# EAGLE design Dormio (EAGLE 9.3.0)
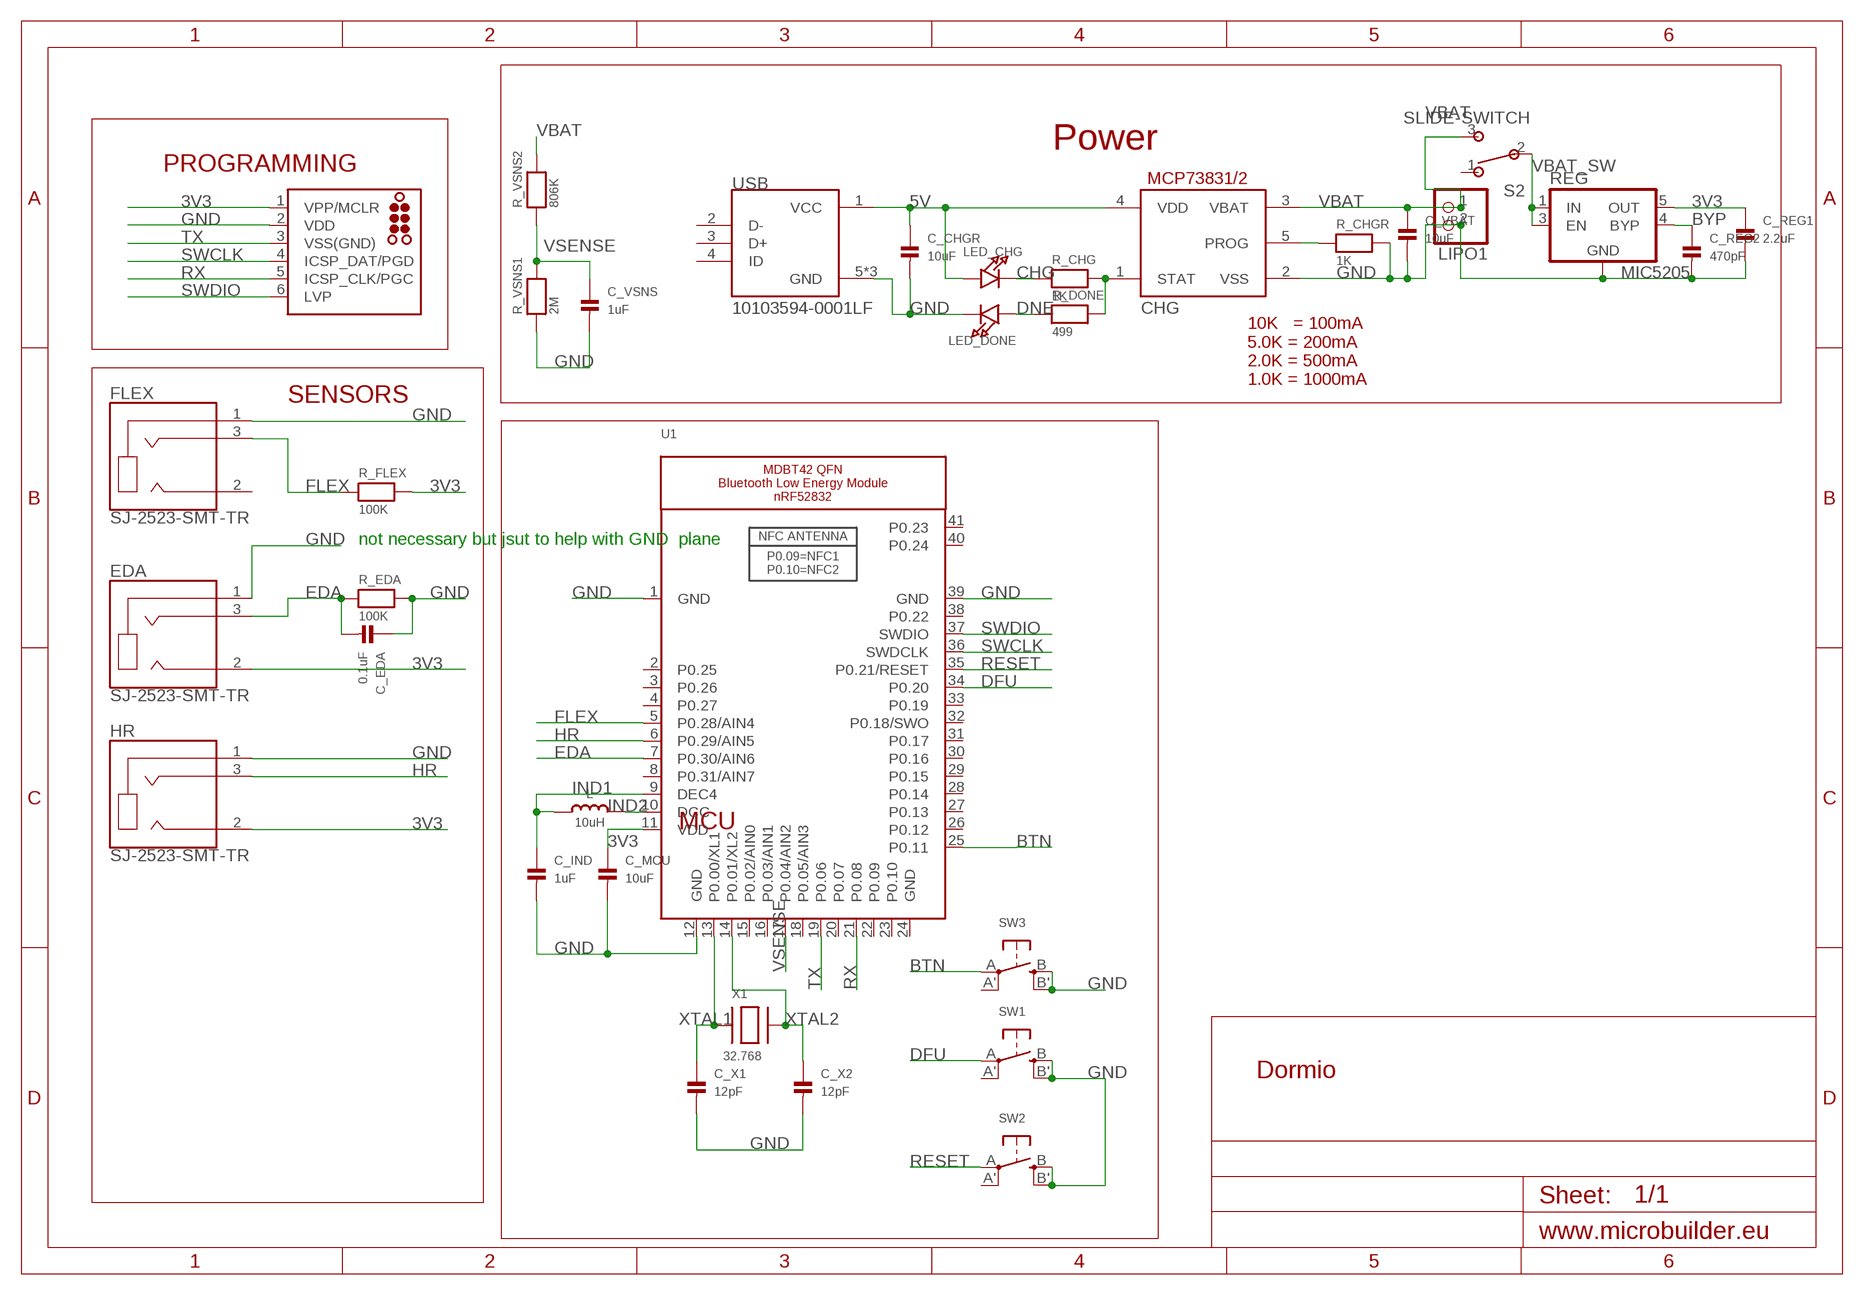
[diagram p0: schematic, sheet 1]

## Parts
C_CHGR  10uF  CAP_CERAMIC1206  [1206]
C_EDA  0.1uF  CAP_CERAMIC1206  [1206]
C_IND  1uF  CAP_CERAMIC1206  [1206]
C_MCU  10uF  CAP_CERAMIC1206  [1206]
C_REG1  2.2uF  CAP_CERAMIC1206  [1206]
C_REG2  470pF  CAP_CERAMIC1206  [1206]
C_VBAT  10uF  CAP_CERAMIC1206  [1206]
C_VSNS  1uF  CAP_CERAMIC1206  [1206]
C_X1  12pF  CAP_CERAMIC1206  [1206]
C_X2  12pF  CAP_CERAMIC1206  [1206]
CHG  MCP73831/OT  [SOT23-5L]
EDA  SJ-2523-SMT-TR  [CUI_SJ-2523-SMT-TR]
FLEX  SJ-2523-SMT-TR  [CUI_SJ-2523-SMT-TR]
HR  SJ-2523-SMT-TR  [CUI_SJ-2523-SMT-TR]
J1  TC2030-MCP-NL  [TC2030-MCP-NL]
L  10uH  MICROBUILDER_INDUCTOR  [MICROBUILDER_INDUCTOR_1007]
LED_CHG  LED1206  [CHIPLED_1206]
LED_DONE  LED1206  [CHIPLED_1206]
LIPO1  JST_2PIN-SMT-RA  [JST-PH-2-SMT-RA]
R_CHG  1K  RESISTOR1206  [1206]
R_CHGR  1K  RESISTOR1206  [1206]
R_DONE  499  RESISTOR1206  [1206]
R_EDA  100K  RESISTOR1206  [1206]
R_FLEX  100K  RESISTOR1206  [1206]
R_VSNS1  2M  RESISTOR1206  [1206]
R_VSNS2  806K  RESISTOR1206  [1206]
REG  MIC5205  [SOT23-5]
S2  SLIDE-SWITCH  [AYZ0102AGRLC]
SW1  MICROBUILDER_SWITCH_TACT_SMT4.6X2.8  [MICROBUILDER_BTN_KMR2_4.6X2.8]
SW2  MICROBUILDER_SWITCH_TACT_SMT4.6X2.8  [MICROBUILDER_BTN_KMR2_4.6X2.8]
SW3  MICROBUILDER_SWITCH_TACT_SMT4.6X2.8  [MICROBUILDER_BTN_KMR2_4.6X2.8]
U1  MICROBUILDER_NRF52832_MODULE_MDBT42  [MICROBUILDER_BLE_MODULE_RAYTAC_MDBT42]
USB  10103594-0001LF  [FCI_10103594-0001LF]
X1  32.768  XTAL-3.2X1.5  [XTAL3215]

## Nets
3V3: C_MCU.1 C_REG1.1 EDA.2 HR.2 J1.1(VPP/MCLR) R_FLEX.2 REG.5(OUT) U1.11(VDD)
5V: C_CHGR.1 CHG.4(VDD) LED_CHG.A USB.1(VCC)
BTN: SW3.A(P) U1.25(P0.11)
BYP: C_REG2.1 REG.4(BYP)
CHG: LED_CHG.C R_CHG.1
DFU: SW1.A(P) U1.34(P0.20)
DNE: LED_DONE.A R_DONE.1
EDA: C_EDA.2 EDA.3 R_EDA.1 U1.7(P0.30/AIN6)
FLEX: FLEX.3 R_FLEX.1 U1.5(P0.28/AIN4)
GND: C_CHGR.2 C_EDA.1 C_IND.2 C_MCU.2 C_REG1.2 C_REG2.2 C_VBAT.2 C_VSNS.2 C_X1.2 C_X2.2 CHG.2(VSS) EDA.1 FLEX.1 HR.1 J1.2(VDD) LED_DONE.C LIPO1.2 R_CHGR.2 R_EDA.2 R_VSNS1.1 REG.2(GND) SW1.B'(S1) SW1.B(S) SW2.B'(S1) SW2.B(S) SW3.B'(S1) SW3.B(S) U1.1(GND) U1.12(GND) U1.39(GND) USB.5(GND) USB.P3(GND) USB.P4(GND)
HR: HR.3 U1.6(P0.29/AIN5)
IND1: C_IND.1 L.P$1 U1.9(DEC4)
IND2: L.P$2 U1.10(DCC)
PROG: CHG.5(PROG) R_CHGR.1
RESET: SW2.A(P) U1.35(P0.21/RESET)
RX: J1.5(ICSP_CLK/PGC) U1.21(P0.08)
STAT: CHG.1(STAT) R_CHG.2 R_DONE.2
SWCLK: J1.4(ICSP_DAT/PGD) U1.36(SWDCLK)
SWDIO: J1.6(LVP) U1.37(SWDIO)
TX: J1.3(VSS(GND)) U1.19(P0.06)
VBAT: C_VBAT.1 CHG.3(VBAT) LIPO1.1 R_VSNS2.2 S2.3
VBAT_SW: REG.1(IN) REG.3(EN) S2.2
VSENSE: C_VSNS.1 R_VSNS1.2 R_VSNS2.1 U1.17(P0.04/AIN2)
XTAL1: C_X1.1 U1.13(P0.00/XL1) X1.P$1
XTAL2: C_X2.1 U1.14(P0.01/XL2) X1.P$2
Unconnected: FLEX.2 S2.1 SW1.A'(P1) SW2.A'(P1) SW3.A'(P1) U1.2(P0.25) U1.3(P0.26) U1.4(P0.27) U1.8(P0.31/AIN7) U1.15(P0.02/AIN0) U1.16(P0.03/AIN1) U1.18(P0.05/AIN3) U1.20(P0.07) U1.22(P0.09) U1.23(P0.10) U1.24(GND) U1.26(P0.12) U1.27(P0.13) U1.28(P0.14) U1.29(P0.15) U1.30(P0.16) U1.31(P0.17) U1.32(P0.18/SWO) U1.33(P0.19) U1.38(P0.22) U1.40(P0.24) U1.41(P0.23) USB.2(D-) USB.3(D+) USB.4(ID)

## Notes on the sheet
- Power
- PROGRAMMING
- 10K   = 100mA
  5.0K = 200mA
  2.0K = 500mA
  1.0K = 1000mA
- SENSORS
- not necessary but jsut to help with GND  plane
- MCU

## Library data of the parts
C_CHGR C_EDA C_IND C_MCU C_REG1 C_REG2 C_VBAT C_VSNS C_X1 C_X2 = microbuilder:CAP_CERAMIC: Ceramic Capacitors 0402 - 0402 Surface Mount Capacitors 16pF 50V 5% [Digikey: 445-4899-2-ND] 18pF 50V 5% [Digikey: 490-1281-2-ND] 22pF 50V 5% [Digikey: 490-1283-2-ND] 68pF 50V 5% [Digikey: 490-1289-2-ND] 0.1uF 10V 10% [Digikey: 490-1318-2-ND] 1.0uF 6.3V 10% [Digikey: 490-1320-2-ND] 0603 - 0603 Surface Mount Capacitors 16 pF 50V 5% [Digikey: 445-5051-2-ND] 22 pF 50V [Digikey: PCC220ACVTR-ND] 33 pF 50V 5% [Digikey: 490-1415-1-ND] 56pF 50V 5% [Digikey: 490-1421-1-ND] 220pF 50V 5% [Digikey: 445-1285-1-ND] 680 pF 50V 2200 pF 50V 5% C0G [Digikey: 445-1297-1-ND] 5600 pF 100V 5% X7R [Digikey: 478-3711-1-ND] 0.1 µF 25V 10% [Digikey: PCC2277TR-ND] 0.22 µF 16V 10% X7R [Digikey: 445-1318-1-ND] 1.0 µF 25V 10% [Digikey: 445-5146-2-ND] 0603 - RF Specific 3pF 250V +/-0.1pF RF [Digikey: 712-1347-1-ND] 18 pF 250V 5% [Digikey: 478-3505-1-ND or 712-1322-1-ND] 56 pF 250V 5% C0G RF [Digikey: 490-4867-1-ND] 68 pF 250V RF [Digikey: 490-4868-1-ND] 0805 - 0805 Surface Mount Capacitors 220 pF 250V 2% RF Ceramic Capacitor [Digikey: 712-1398-1-ND] 1000 pF 50V 2% NP0 Ceramic Capacitor [Digikey: 478-3760-1-ND] 0.1 µF 25V 10% Ceramic Capacitor [Digikey: PCC1828TR-ND] 1.0 µF 16V 10% Ceramic Capacitor[Digikey: 490-1691-2-ND] 10.0 µF 10V 10% Ceramic Capacitor[Digikey: 709-1228-1-ND] 10.0 uF 16V 10% Ceramic Capacitor [Digikey: 478-5165-2-ND] 47 uF 6.3V 20% Ceramic Capacitor [Digikey: 587-1779-1-ND or 399-5506-1-ND] 1206 - 1206 Surface Mount Capacitors 47uF 10V 20% Ceramic Capacitor [Digikey: 490-5528-1-ND or 399-5508-1-ND or 445-6010-1-ND] 100uF 6.3V -20%, +80% Y5V Ceramic Capacitor (Digikey: 490-4512-1-ND, Mouser: 81-GRM31CF50J107ZE1L)
CHG = adafruit:MCP73831: MCP73831/2 Miniature Single-Cell, Fully Integrated Li-Ion, Li-Polymer Charge Management Controllers. Nice and small simple lipoly charge controller, with adjustable current and status output (LED) http://www.ladyada.net/library/pcb/eaglelibrary.html
EDA FLEX HR = SJ-2523-SMT-TR:SJ-2523-SMT-TR: SJ Series 2.5 mm SMT Right Angle Stereo Audio Jack; MANUFACTURER: CUI Inc.; PART_REV: 1.02; STANDARD: Manufacturer Recommendation
J1 = tag-connect:TC2030: TAG-CONNECT ICSP Connector Manufacturer: Tag-Connect <http://www.tag-connect.com> Cable for easy In-Circuit Serial Programming. Designed for Microchip ICD2, suitable for many others. Two variants - one "with legs" (for hands-free fit on PCB) and another "without legs" for quick programming. PAD Description 1 MCLR/Vpp 2 Vdd 3 GND 4 PGD (ISPDAT) 5 PGC (ISPCLK) 6 nc (used for LVP) ©2009 ROFA.cz - modified and updated by Robert Darlington ‹rdarlington@gmail.com›
L = Adafruit nRF52 Bluefruit Feather rev G:MICROBUILDER_INDUCTOR: Inductors 0603: 10nH Ceramic Inductor - microwire antenna/RF (Digikey: 712-1434-2-ND) 0805: 560nH Ceramic Inductor - RF (Digikey: 553-1047-1-ND) 270nH Ceramic Inductor - Q = 40@250MHz, +-5%, 1 Ohm DC Resistance (Digikey: 535-10506-2-ND) 1007 (2518 Metric) SMT: 10µH 10% 250mOhm 820mA 1007 Inductor (Digikey: 587-2189-1-ND) 22µH 10% 500mOhm 580mA 1007 Inductor (Digikey: 587-2190-1-ND) 47µH 10% 950mOhm 420mA 1007 Inductor (Digikey: 587-2191-1-ND) 47µH 5% 100mOhm 1A 1008 Inductor (Digikey: 732-1816-1-ND) 5.0x5.0mm (Taiyo Yuden NR5040 Series) 6.8µH 20% 2.3A 64mOhm Inductor (Digikey: 587-2374-2-ND) 5.0x5.0mm (TDK VLC5045 Series) 4.7µH 20% 3.3A 34mOhm Inductor (Digikey: 445-6526-1-ND) 6.8µH 20% 2.7A 46mOhm Inductor (Digikey: 445-6527-1-ND) 6.0x6.0mm (TDK VLC6045 Series) 4.7µH 20% 3.8A 27mOhm Inductor (Digikey: 445-6538-2-ND) 6.8µH 20% 3A 41mOhm Inductor (Digikey: 445-6540-1-ND) 6.2µH 30% 2.2A 45mOhm Inductor (Digikey: SRR5028-6R2YCT-ND) - Not TDK VLC6045 but footprint should match 6.0x6.0mm (TDK SLF6045 Series) 6.8uH 30% 2A 33mOhm Inductor (Digikey: 445-4572-1-ND, Mouser: 810-SLF645T6R8N2R0PF) 6.0x6.0mm (Sumida CDRH5D28 Series) 6.2uH 30% 1.8A 45mOhm Inductor (Digikey: 308-1542-1-ND) Taiyo Yuden NR3015T2R2M - 2.2uH 20% 1.5A (Digikey: 587-1648-2-ND, Mouser: 963-NR3015T2R2M) - Used with TI TPS62172 CoilCraft RFID Transponder Coil - MA5532-AE (For use with AS3935 Lightning Sensor) Taiyo Yuden NRH2412T2R2MNGH - 2.2uH 20% 1AA (Digikey: 587-3443-1-ND) - Used with TI LM3671 Vishay IHLP 1.0uH Molded Inductor - 24mOhm DCR, 5A, +/-20%, -55°C-125°C (Digikey: 541-1319-1-ND)
LED_CHG LED_DONE = microbuilder:LED: LED 0603 - 0603 Surface Mount Package 2mA: Green LED - Low Power (3.9mcd, 2ma, 1.7Vf) - Digikey: 475-2709-2-ND Orange LED - Low Power (9.8mcd, 2ma, 1.8Vf) - Digikey: 475-1194-2-ND Red LED - Low Power (5mcd, 2ma, 1.8Vf) - Digikey: 475-1195-2-ND Yellow LED - Low Power (7mcd, 2ma, 1.8Vf) - Digikey: 475-1196-2-ND 5mA: Blue LED - Low Power (17mcd, 5ma, 2.9Vf) - Digikey: LNJ937W8CRACT-ND 0805 - 0805 Surface Mount Package 2mA: Red LED (8.8mcd, 2mA, 1.8Vf, Clear) - Low Power [Digikey: 475-2510-1-ND] Green LED (5mcd, 2mA, 1.8Vf, Clear) - Low Power [Digikey: 475-2730-1-ND] Yellow LED (11.3mcd, 2mA, 1.8Vf, Clear) - Low Power [Digikey: 475-2555-1-ND] 20mA: Red LED (104mcd, 20mA, Diffused) - LS R976 [Digikey: 475-1278-6-ND] Red LED (12mcd, 20mA, 2.0Vf, Clear) - APT2012EC [Digikey: 754-1128-1-ND] Green LED (15mcd, 20mA, 2.2Vf, Clear) - APT2012GC [Digikey: 754-1131-1-ND] Orange LED (160mcd, 20mA, 2.1Vf, Clear) - APT2012SECK [Digikey: 754-1130-1-ND] 1206 - 1206 Surface Mount Package Green LED (26mcd, 20mA, Diffused) - LG N971 [Digikey: 475-1407-6-ND] Red LED (15mcd, 20mA, Diffused) - LH N974 [Digikey: 475-1416-6-ND]
LIPO1 = adafruit:JST_2PIN: JST 2-Pin Connectors of various flavors SMT-RA (S2B-PH-SM4) 4UConnector #17311 SMT (B2B-PH-SM4) THM-RA (S2B-PH) THM (B2B-PH)
R_CHG R_CHGR R_DONE R_EDA R_FLEX R_VSNS1 R_VSNS2 = microbuilder:RESISTOR: Resistors 0402 - 0402 Surface Mount Package 22 Ohm 1% 1/16W [Digikey: 311-22.0LRTR-ND] 33 Ohm 5% 1/16W 1.0K 5% 1/16W 1.5K 5% 1/16W 2.0K 1% 1/16W 10.0K 1% 1/16W [Digikey: 311-10.0KLRTR-ND] 10.0K 5% 1/16W [Digikey: RMCF0402JT10K0TR-ND] 12.1K 1% 1/16W [Digikey: 311-22.0LRTR-ND] 100.0K 5% 1/16W 0603 - 0603 Surface Mount Package 0 Ohm 1/10 Watt 1% Resistor 15 Ohm 1/10 Watt 1% Resistor 33 Ohm 1/10 Watt 1% Resistor 49.9 Ohm 1/10 Watt 1% Resistor 100 Ohm 1/10 Watt 1% Resistor 150 Ohm 1/10 Watt 1% Resistor 240 Ohm 1/10 Watt 1% Resistor 390 Ohm 1/10 Watt 1% Resistor 560 Ohm 1/10 Watt 1% Resistor 680 Ohm 1/10 Watt 1% Resistor 750 Ohm 1/10 Watt 1% Resistor 1.0K Ohm 1/10 Watt 1% Resistor 1.5K Ohm 1/10 Watt 1% Resistor 2.0K Ohm 1/10 Watt 1% Resistor 2.2K Ohm 1/10 Watt 1% Resistor 3.3K Ohm 1/10 Watt 1% Resistor 4.7K Ohm 1/10 Watt 1% Resistor 10.0K Ohm 1/10 Watt 1% Resistor 12.0K Ohm 1/10 Watt 1% Resistor 12.1K Ohm 1/10 Watt 1% Resistor 20.0K Ohm 1/10 Watt 1% Resistor 33.0K Ohm 1/10 Watt 1% Resistor 100.0K Ohm 1/10 Watt 1% Resistor 0805 - 0805 Surface Mount Package 0 Ohm 1/8 Watt 1% Resistor 33 Ohm 1/8 Watt 1% Resistor 100 Ohm 1/8 Watt 1% Resistor 150 Ohm 1/8 Watt 1% Resistor 200 Ohm 1/8 Watt 1% Resistor 240 Ohm 1/8 Watt 1% Resistor 330 Ohm 1/8 Watt 1% Resistor 390 Ohm 1/8 Watt 1% Resistor 470 Ohm 1/8 Watt 1% Resistor 1.0K Ohm 1/8 Watt 1% Resistor 1.5K Ohm 1/8 Watt 1% Resistor 2.0K Ohm 1/8 Watt 1% Resistor 4.7K Ohm 1/8 Watt 1% Resistor 5.1K Ohm 1/8 Watt 1% Resistor 5.6K Ohm 1/8 Watt 1% Resistor 10.0K Ohm 1/8 Watt 1% Resistor 22.0K Ohm 1/8 Watt 1% Resistor 33.0K Ohm 1/8 Watt 1% Resistor 100K Ohm 1/8 Watt 1% Resistor 1206 - 1206 Surface Mount Package 2012 - 2010 Surface Mount Package 0.11 Ohm 1/2 Watt 1% Resistor - Digikey: RHM.11UCT-ND
REG = regulator:MIC5205: ULDO Voltage regulator Voltage input: 2.5-16V Guaranteed 150mA output Low dropout voltage: < 350mV @ 150mA, < 70mV @ 50mA High output voltage accuracy (1%) Ultra-low-noise output Low quiescent current Reverse-battery protection “Zero” off-mode current Logic-controlled electronic enable The MIC5205 is an efficient linear voltage regulator with ultra low-noise output, very low dropout voltage (typically 17mV at light loads and 165mV at 150mA), and very low ground current (600⎧A at 100mA output). The MIC5205 offers better than 1% initial accuracy. Designed especially for hand-held, battery-powered devices, the MIC5205 includes a CMOS or TTL compatible enable/shutdown control input. When shut down, power consumption drops nearly to zero. Regulator ground current increases only slightly in dropout, further prolonging battery life. Key MIC5205 features include a reference bypass pin to improve its already excellent low-noise performance, reversed-battery protection, current limiting, and overtemperature shutdown. datasheet.pdf <http://www.micrel.com/_PDF/mic5205.pdf>
S2 = fab:SLIDE-SWITCH: SMD slide-switch AYZ0102AGRLC as found in the fablab inventory. Includes the mounting holes. Made by Zaerc.
SW1-SW3 = Adafruit nRF52 Bluefruit Feather rev G:MICROBUILDER_SWITCH_TACT_SMT: SMT Tact Switches 6x6mm - Digikey: P12940SCT-ND KMR2 (4.6x2.8mm) - Digikey: 401-1426-1-ND EVQ-PQHB55 - Light Touch, 160GF (4.5x4.5mm) - Digikey: P8090SCT-ND KMT0 - KMT021 NGJ LHS (etc.) IP68/Waterproof - Digikey: CKN10289CT-ND
U1 = Adafruit nRF52 Bluefruit Feather rev G:MICROBUILDER_NRF52832_MODULE_MDBT42: MDBT42 - BLE Module (nRF52832 QFN) VDD: 1.7-3.6V; SPICEPREFIX: X
USB = 10103594-0001LF:10103594-0001LF: Conn Micro USB Type B RCP 5 POS 0.65mm Solder RA SMD 5 Terminal 1 Port T/R; AVAILABILITY: Good; DESCRIPTION: Conn Micro USB Type B RCP 5 POS 0.65mm Solder RA SMD 5 Terminal 1 Port T/R; MF: FCI; MP: 10103594-0001LF; PACKAGE: None; PRICE: 0.40 USD
X1 = adafruit:XTAL: Low cost SMT crystals, no capacitors included http://www.ladyada.net/library/eagle

## Board
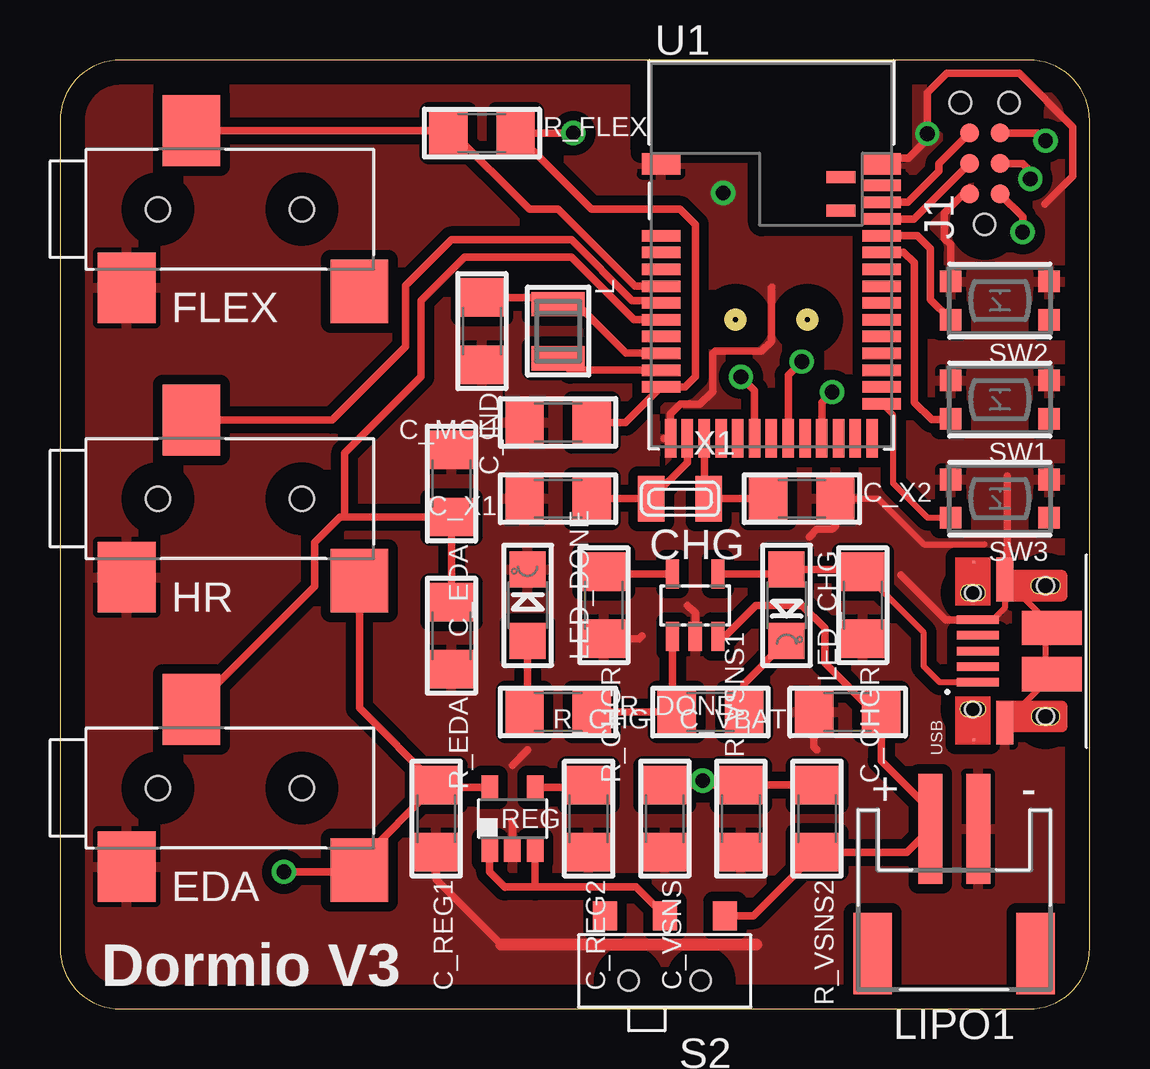
[diagram p1: board, top side]
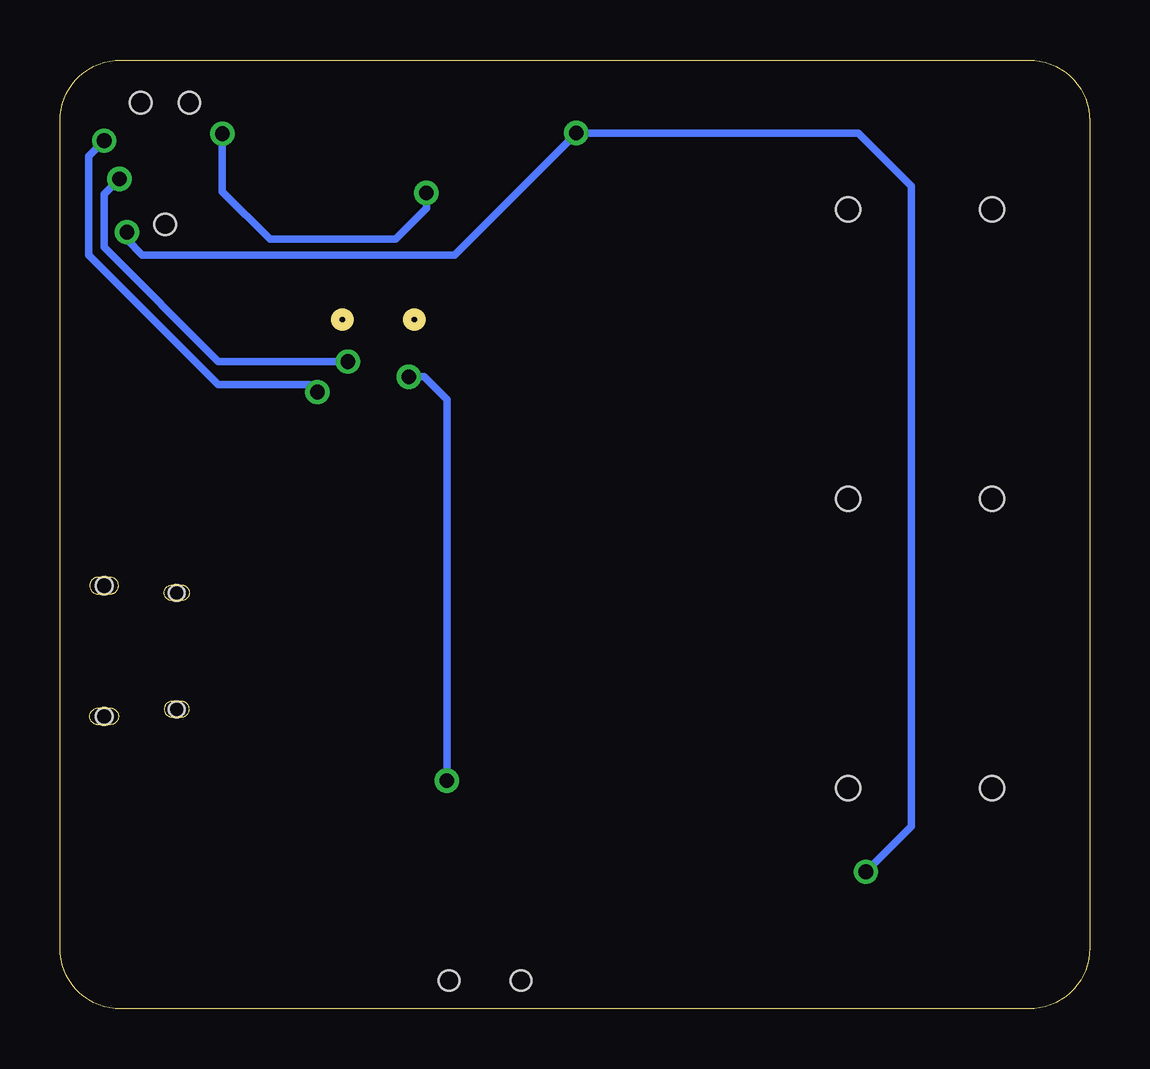
[diagram p2: board, bottom side, seen from below]

Size 42.93 x 39.56 mm. Coordinates in mm from the lower left corner, seen from the top.
Outline: 40.39,39.56 2.54,39.56 arc90 0,37.02 0,2.54 arc90 2.54,0 40.39,0 arc90 42.93,2.54 42.93,37.02 arc90 40.39,39.56
Outline: circle at 31.15,28.74 radius 0.28
Outline: circle at 28.16,28.74 radius 0.28
Copper layers (1*16): Top 0.035mm / dielectric 1.5mm / Bottom 0.035mm
Design rules "default *": minimum track width 10mil, minimum drill 24mil, track to track 8mil, track to pad 8mil, pad to pad 8mil, via to via 8mil, smd to smd 8mil, copper to edge 40mil, drill to drill 8mil, minimum pad ring 10mil, minimum via ring 8mil, stop-mask expansion 4mil, vias tented up to drill 0mil, thermal gap 8mil
tRestrict: area 24.3,32.8 to 34.9,39.3

### Footprints (pad centres in the part's own frame; a part is rotated, then mirrored left to right if it is on the bottom)
1206 = smd 1.6 x 1.8: 1 -1.4,0; 2 1.4,0
SOT23-5L = smd 0.55 x 1.2: 1 -0.95,-1.3; 2 0,-1.3; 3 0.95,-1.3; 4 0.95,1.3; 5 -0.95,1.3
CUI_SJ-2523-SMT-TR = smd 2.4 x 2.95: 1 1.7,-3.275; 3 4.4,3.275 | smd 2.4 x 2.65: 2 11.4,-3.425 | hole 1: 3,0; 9,0
TC2030-MCP-NL = smd 0.787 x 0.787: 1 1.27,-0.635; 2 1.27,0.635; 3 2.54,-0.635; 4 2.54,0.635; 5 3.81,-0.635; 6 3.81,0.635 | hole 0.889: 0,0; 5.08,-1.016; 5.08,1.016
MICROBUILDER_INDUCTOR_1007 = smd 1.016 x 2.2: P$1 -1.127,0; P$2 1.127,0
CHIPLED_1206 = smd 1.5 x 1.5: A 0,-1.496; C 0,1.496
JST-PH-2-SMT-RA = smd 1 x 4.6: 1 1,-3.7; 2 -1,-3.7 | smd 1.6 x 3.4: NC1 -3.4,1.5; NC2 3.4,1.5
SOT23-5 = smd 0.69 x 0.99: 1 -0.95,-1.3; 2 0,-1.3; 3 0.95,-1.3; 4 0.95,1.3; 5 -0.95,1.3
AYZ0102AGRLC = smd 1 x 1.2: 1 2.5,-2.3; 2 0,-2.3; 3 -2.5,-2.3 | hole 0.85: -1.5,0.4; 1.5,0.4
MICROBUILDER_BTN_KMR2_4.6X2.8 = smd 0.9 x 0.9: A 2.05,0.8; A' -2.05,0.8; B 2.05,-0.8; B' -2.05,-0.8
MICROBUILDER_BLE_MODULE_RAYTAC_MDBT42 = smd 1.6 x 0.9: 1 -4.6,3.8; 39 4.6,3.8 | smd 1.6 x 0.48: 2 -4.6,0.8; 3 -4.6,0.1; 4 -4.6,-0.6; 5 -4.6,-1.3; 6 -4.6,-2; 7 -4.6,-2.7; 8 -4.6,-3.4; 9 -4.6,-4.1; 10 -4.6,-4.8; 11 -4.6,-5.5; 25 4.6,-6.2; 26 4.6,-5.5; 27 4.6,-4.8; 28 4.6,-4.1; 29 4.6,-3.4; 30 4.6,-2.7; 31 4.6,-2; 32 4.6,-1.3; 33 4.6,-0.6; 34 4.6,0.1; 35 4.6,0.8; 36 4.6,1.5; 37 4.6,2.2; 38 4.6,2.9 | smd 0.48 x 1.6: 12 -4.2,-7.65; 13 -3.5,-7.65; 14 -2.8,-7.65; 15 -2.1,-7.65; 16 -1.4,-7.65; 17 -0.7,-7.65; 18 0,-7.65; 19 0.7,-7.65; 20 1.4,-7.65; 21 2.1,-7.65; 22 2.8,-7.65; 23 3.5,-7.65; 24 4.2,-7.65 | smd 1.2 x 0.5: 40 2.9,3.25; 41 2.9,1.85
FCI_10103594-0001LF = smd 0.356 x 1.75: 1 -1.3,2.825; 2 -0.65,2.825; 3 0,2.825; 4 0.65,2.825; 5 1.3,2.825 | smd 0.1 x 0.1: P1 -3.7,3; P2 3.7,3 | smd 1.825 x 0.7: P3 -2.987,1.7; P4 2.987,1.7 | smd 1.425 x 2.5: P5 -0.963,-0.25; P6 0.963,-0.25 | hole 0.7: -2.725,0; 2.725,0 | hole 0.65: -2.425,3.03; 2.425,3.03
XTAL3215 = smd 1.1 x 1.9: P$1 1.2,0; P$2 -1.2,0

### Placement (x,y rotation side)
C_CHGR  33.46,16.83 270 top
C_EDA  16.32,21.91 270 top
C_IND  17.59,28.26 270 top
C_MCU  20.76,24.45 180 top
C_REG1  15.68,7.94 270 top
C_REG2  22.03,7.94 270 top
C_VBAT  32.83,12.38 180 top
C_VSNS  25.21,7.94 270 top
C_X1  20.76,21.27 180 top
C_X2  30.92,21.27 0 top
CHG  26.48,16.83 0 top
EDA  1.08,9.21 0 top
FLEX  1.08,33.34 0 top
HR  1.08,21.27 0 top
J1  38.54,32.7 90 top
L  20.76,28.26 270 top
LED_CHG  30.29,16.83 180 top
LED_DONE  19.49,16.83 0 top
LIPO1  37.27,3.81 180 top
R_CHG  27.11,12.38 180 top
R_CHGR  22.67,16.83 270 top
R_DONE  20.76,12.38 0 top
R_EDA  16.32,15.56 270 top
R_FLEX  17.59,36.51 0 top
R_VSNS1  28.38,7.94 90 top
R_VSNS2  31.56,7.94 270 top
REG  18.86,7.94 0 top
S2  25.21,1.59 180 top
SW1  39.18,25.4 180 top
SW2  39.18,29.53 180 top
SW3  39.18,21.27 180 top
U1  29.65,31.43 0 top
USB  41.08,14.92 90 top
X1  25.84,21.27 180 top

### Tracks (layer width: path | path; a pad name or v marks a point on that pad's centre or on a via)
3V3  (via drill 0.61)
  Top 0.305: C_REG1.1 12.48,6.13 EDA.2 12.41,5.71 v9.33,5.71 | C_MCU.1 23.57,24.45 U1.11 26.06,25.93 26.48,26.35 26.48,32.7 25.84,33.34 22.16,33.34 R_FLEX.2 v21.4,36.51 | REG.5 15.78,9.24 C_REG1.1 | C_REG1.1 12.48,12.54 HR.2 | J1.1 40.13,33.02 v40.13,32.38
  Bottom 0.305: v40.13,32.38 40.13,32.07 39.5,31.43 26.48,31.43 v21.4,36.51 9.65,36.51 7.43,34.29 7.43,7.62 v9.33,5.71
5V
  Top 0.254: C_CHGR.1 36,15.69 36,14.29 36.67,13.62 USB.1
  Top 0.305: CHG.4 30.09,18.13 LED_CHG.A 33.37,18.32 C_CHGR.1
BTN
  Top 0.254: SW3.A 36.17,20.47 34.73,21.91 34.73,24.75 U1.25
BYP
  Top 0.305: REG.4 21.93,9.24 C_REG2.1
CHG
  Top 0.305: LED_CHG.C 28.51,13.56 R_CHG.1
DFU
  Top 0.305: SW1.A 37.1,24.57 36.33,24.57 35.62,25.29 35.62,31.1 35.17,31.56 35.14,31.53 U1.34
DNE
  Top 0.305: LED_DONE.A 19.49,12.51 R_DONE.1
EDA
  Top 0.305: U1.7 23.93,28.73 21.32,31.35 16.87,31.35 15.05,29.53 15.05,26.35 11.87,23.18 11.87,20.51 | EDA.3 10.6,17.61 10.6,19.44 11.67,20.51 11.87,20.51 | 11.87,20.51 C_EDA.2 R_EDA.1
FLEX
  Top 0.305: FLEX.3 16.29,36.61 | 16.29,36.61 R_FLEX.1 | U1.5 23.97,30.13 20.76,33.34 19.56,33.34 16.29,36.61
GND  (via drill 0.61)
  Top 0.254: USB.P3 41.08,13.64 41.08,16.21 USB.P4 39.38,16.71 38.86,16.19 38.83,16.22 37.91,16.22 | C_X2.2 34.1,21.27 36,19.37 38.54,19.37
  Top 0.305: USB.5 37.91,16.22 36.93,16.22 35.05,18.1 | 39.5,22.22 39.5,18.02 USB.P4 | USB.P3 39.38,12.59 | CHG.2 26.48,16.51 26.16,16.83 | 24.26,15.56 24.13,15.43 R_CHGR.2 | C_VBAT.2 31.43,10.93 31.56,10.79 | 19.49,10.79 18.86,10.16 | C_REG1.2 15.68,5.4 18.39,2.69 | 31.24,19.69 31.56,20 32.19,20 32.32,20.13 C_X2.2 | 25.18,23.78 U1.12 25.45,24.79 25.87,25.21 26.68,25.21 27.22,25.74 27.22,27.32 27.32,27.42 29.25,27.42 29.65,27.83 29.65,30.06 29.68,30.09 | U1.39 34.49,35.47 35.37,35.47 36.16,36.26 v36.16,36.49 36.16,38.19 36.97,39 39.99,39 42.23,36.77 42.23,34.71 41.06,33.54 | SW2.B 37.13,31.86 36.87,32.12 36.87,33.19 37.66,33.97 J1.2 | REG.2 18.86,7.81 18.83,7.84
  Top 0.508: 18.39,2.69 29.02,2.69
  Bottom 0.305: v36.16,36.49 36.16,34.07 34.18,32.09 28.94,32.09 27.65,33.39 v27.65,34.02
  pour Top (isolate 0.406, rank 3): 42.74,42.23 42.74,-0.77 0.44,-0.95 0.44,42.23
HR
  Top 0.305: U1.6 24.95,29.54 23.85,29.54 21.32,32.07 16.32,32.07 14.41,30.16 14.41,27.62 11.34,24.55 HR.3
IND1
  Top 0.305: C_IND.1 20.49,29.66 L.P$1 21.54,29.38 23.59,27.33 U1.9
IND2
  Top 0.305: U1.10 21.26,26.63 L.P$2
PROG
  Top 0.305: CHG.5 22.77,18.13 R_CHGR.1
RESET
  Top 0.305: SW2.A 36.28,29.57 36.28,31.69 35.74,32.23 U1.35
RX  (via drill 0.61)
  Top 0.305: U1.21 31.75,25.28 v32.19,25.72 | J1.5 40.77,36.51 v41.08,36.19
  Bottom 0.305: v32.19,25.72 32.51,26.04 36.32,26.04 41.72,31.43 41.72,35.56 v41.08,36.19
STAT
  Top 0.305: CHG.1 25.53,12.57 R_CHG.2 R_DONE.2
SWCLK
  Top 0.305: J1.4 35.6,32.93 U1.36
SWDIO
  Top 0.305: U1.37 35.35,33.63 36.64,34.92 36.64,35.24 J1.6
TX  (via drill 0.61)
  Top 0.305: v30.92,26.99 30.35,26.42 U1.19 | v40.45,34.61 40.45,34.92 40.13,35.24 J1.3
  Bottom 0.305: v40.45,34.61 41.08,33.97 41.08,31.75 36.32,26.99 v30.92,26.99
VBAT
  Top 0.305: S2.3 28.91,3.89 R_VSNS2.2 35.3,6.54 LIPO1.1 36.32,7.56 36.32,8.25 34.23,10.35 C_VBAT.1 33.91,12.38 31.88,14.42 31.88,15.87 30.92,16.83 29.02,16.83 27.72,15.53 CHG.3
VBAT_SW
  Top 0.305: 19.81,5.08 REG.3 | 19.81,5.08 18.54,5.08 17.91,5.71 REG.1 | S2.2 24.01,5.08 19.81,5.08
VSENSE  (via drill 0.61)
  Top 0.305: R_VSNS1.2 C_VSNS.1 26.61,9.34 v26.8,9.52 26.98,9.34 R_VSNS1.2 | R_VSNS1.2 R_VSNS2.1 | v28.38,26.35 28.95,25.78 U1.17
  Bottom 0.305: v26.8,9.52 26.8,25.4 27.75,26.35 v28.38,26.35
XTAL1
  Top 0.305: C_X1.1 X1.P$1 26.15,22.78 U1.13
XTAL2
  Top 0.305: C_X2.1 X1.P$2 26.85,21.46 U1.14

### Text on the board
tPlace: Dormio V3
Document: GND | GPIO1 | GPIO0 | RST | 3.3V
tSilk: FLEX | EDA | HEART RATE | To+